# Altium schematic sheet RTD_interface.SchDoc: RTD Interface
size A4
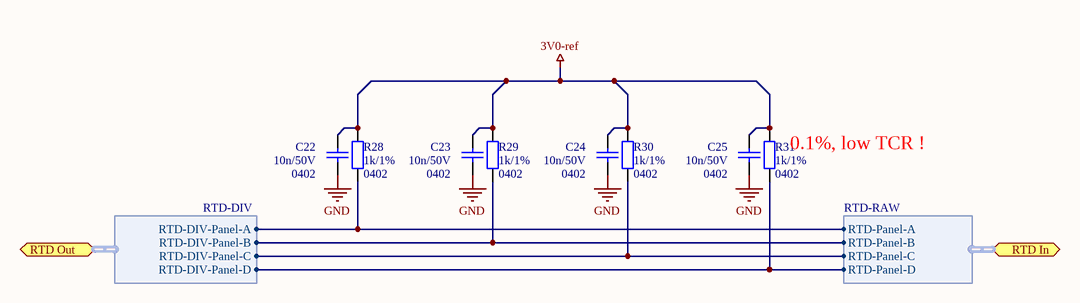
[diagram p0: RTD_interface.SchDoc]

## Parts
C22  Package: 0402  [SMD_Capacitor_0402]  (hidden comment: 10n/50V)
C23  Package: 0402  [SMD_Capacitor_0402]  (hidden comment: 10n/50V)
C24  Package: 0402  [SMD_Capacitor_0402]  (hidden comment: 10n/50V)
C25  Package: 0402  [SMD_Capacitor_0402]  (hidden comment: 10n/50V)
R28  Package: 0402  [SMD_Resistor_0402]  (hidden comment: 1k/1%)
R29  Package: 0402  [SMD_Resistor_0402]  (hidden comment: 1k/1%)
R30  Package: 0402  [SMD_Resistor_0402]  (hidden comment: 1k/1%)
R31  Package: 0402  [SMD_Resistor_0402]  (hidden comment: 1k/1%)

## Ports
RTD In (harness RTD-RAW), RTD Out (harness RTD-DIV)

## Harnesses
RTD-RAW: RTD-Panel-A, RTD-Panel-B, RTD-Panel-C, RTD-Panel-D
RTD-DIV: RTD-DIV-Panel-A, RTD-DIV-Panel-B, RTD-DIV-Panel-C, RTD-DIV-Panel-D

## Nets
3V0-ref: C22.1 C23.1 C24.1 C25.1 R28.1 R29.1 R30.1 R31.1
GND: C22.2 C23.2 C24.2 C25.2
NetR28_2: R28.2 ; port RTD In.RTD-Panel-A, port RTD Out.RTD-DIV-Panel-A
NetR29_2: R29.2 ; port RTD In.RTD-Panel-B, port RTD Out.RTD-DIV-Panel-B
NetR30_2: R30.2 ; port RTD In.RTD-Panel-C, port RTD Out.RTD-DIV-Panel-C
NetR31_2: R31.2 ; port RTD In.RTD-Panel-D, port RTD Out.RTD-DIV-Panel-D

## Notes on the sheet
- (near R31) 0.1%, low TCR !
- Title:
- Sheet:
- of
- Author:
- Model:
- Document Number:
- Checked by:
- Iss-Rev:
- Approved by:
- Date:
- File name:

## Library data of the parts
C22-C25 = Cer_C0402T103K5RALTU: Ceramic Cap Kemet COTS 10n/50V X7R 0402; ManufacturerPartNumber: C0402T103K5RALTU; Manufacturer: Kemet; Value: 10n/50V
R28-R31 = CRCW04021K00FKxxxx: 1k/1% Vishay CRCW 0402 Resistor. 63mW, 100ppm, 50V.; Manufacturer: Vishay; ManufacturerPartNumber: CRCW04021K00FKxxxx; Value: 1k/1%